# Altium schematic sheet AM-Power.SchDoc
size C
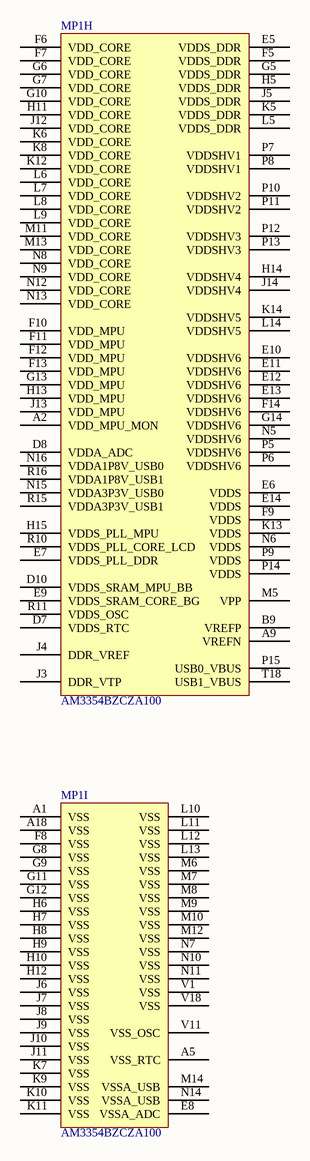
[diagram p0: AM-Power.SchDoc]

## Parts
MP1  AM3354BZCZA100  [TI-ZCZ324]  (parts H,I of 9)

## Nets

Not connected (* = marked no-connect by the designer): MP1 A1(VSS) A2(VDD_MPU_MON) A5(VSS_RTC) A9(VREFN) A18(VSS) B9(VREFP) D7(VDDS_RTC) D8(VDDA_ADC) D10(VDDS_SRAM_MPU_BB) E5(VDDS_DDR) E6(VDDS) E7(VDDS_PLL_DDR) E8(VSSA_ADC) E9(VDDS_SRAM_CORE_BG) E10(VDDSHV6) E11(VDDSHV6) E12(VDDSHV6) E13(VDDSHV6) E14(VDDS) F5(VDDS_DDR) F6(VDD_CORE) F7(VDD_CORE) F8(VSS) F9(VDDS) F10(VDD_MPU) F11(VDD_MPU) F12(VDD_MPU) F13(VDD_MPU) F14(VDDSHV6) G5(VDDS_DDR) G6(VDD_CORE) G7(VDD_CORE) G8(VSS) G9(VSS) G10(VDD_CORE) G11(VSS) G12(VSS) G13(VDD_MPU) G14(VDDSHV6) H5(VDDS_DDR) H6(VSS) H7(VSS) H8(VSS) H9(VSS) H10(VSS) H11(VDD_CORE) H12(VSS) H13(VDD_MPU) H14(VDDSHV4) H15(VDDS_PLL_MPU) J3(DDR_VTP) J4(DDR_VREF) J5(VDDS_DDR) J6(VSS) J7(VSS) J8(VSS) J9(VSS) J10(VSS) J11(VSS) J12(VDD_CORE) J13(VDD_MPU) J14(VDDSHV4) K5(VDDS_DDR) K6(VDD_CORE) K7(VSS) K8(VDD_CORE) K9(VSS) K10(VSS) K11(VSS) K12(VDD_CORE) K13(VDDS) K14(VDDSHV5) L5(VDDS_DDR) L6(VDD_CORE) L7(VDD_CORE) L8(VDD_CORE) L9(VDD_CORE) L10(VSS) L11(VSS) L12(VSS) L13(VSS) L14(VDDSHV5) M5(VPP) M6(VSS) M7(VSS) M8(VSS) M9(VSS) M10(VSS) M11(VDD_CORE) M12(VSS) M13(VDD_CORE) M14(VSSA_USB) N5(VDDSHV6) N6(VDDS) N7(VSS) N8(VDD_CORE) N9(VDD_CORE) N10(VSS) N11(VSS) N12(VDD_CORE) N13(VDD_CORE) N14(VSSA_USB) N15(VDDA3P3V_USB0) N16(VDDA1P8V_USB0) P5(VDDSHV6) P6(VDDSHV6) P7(VDDSHV1) P8(VDDSHV1) P9(VDDS) P10(VDDSHV2) P11(VDDSHV2) P12(VDDSHV3) P13(VDDSHV3) P14(VDDS) P15(USB0_VBUS) R10(VDDS_PLL_CORE_LCD) R11(VDDS_OSC) R15(VDDA3P3V_USB1) R16(VDDA1P8V_USB1) T18(USB1_VBUS) V1(VSS) V11(VSS_OSC) V18(VSS)

## Notes on the sheet
- Title
- Size:
- Date:
- File:
- C
- Number:
- Time:
- Revision:
- Sheet
- of

## Library data of the parts
MP1 = CMP-0547-00017-2: Sitara ARM Cortex-A8 32-Bit RISC Microprocessor, 1 GHz, SGX530 3D Graphics Engine, Programmable Real-Time Unit and Industrial Communication Subsystem (PRU-ICSS), -40 to 105 degC, 324-pin NFBGA (ZCZ), Green (RoHS & no Sb/Br); Manufacturer: Texas Instruments; eQEP: 3; CAN: 2; UART (SCI): 6; ComponentLink2Description: Datasheet; Mounting Technology: Surface Mount; ComponentLink3Description: Package Specification; Operating Temperature: -40 to 105 degC; PackageReference: ZCZ324; ComponentLink3URL: http://www.ti.com/lit/ds/symlink/am3352.pdf; ARM CPU: Cortex-A8; SPI: 2; ComponentLink2URL: http://www.ti.com/lit/ds/symlink/am3352.pdf; ComponentLink1URL: http://www.ti.com/; PackageVersion: 4211570/A; DatasheetVersion: SPRS717F; eCAP: 3; ComponentLink1Description: Manufacturer URL; PartNumber: AM3354BZCZA100; I2C: 3; PackageDescription: 324-Pin Plastic Ball Grid Array, Body 15 x 15 mm, Pitch 0.8 mm